# Altium project LM-CT-001.PrjPcb
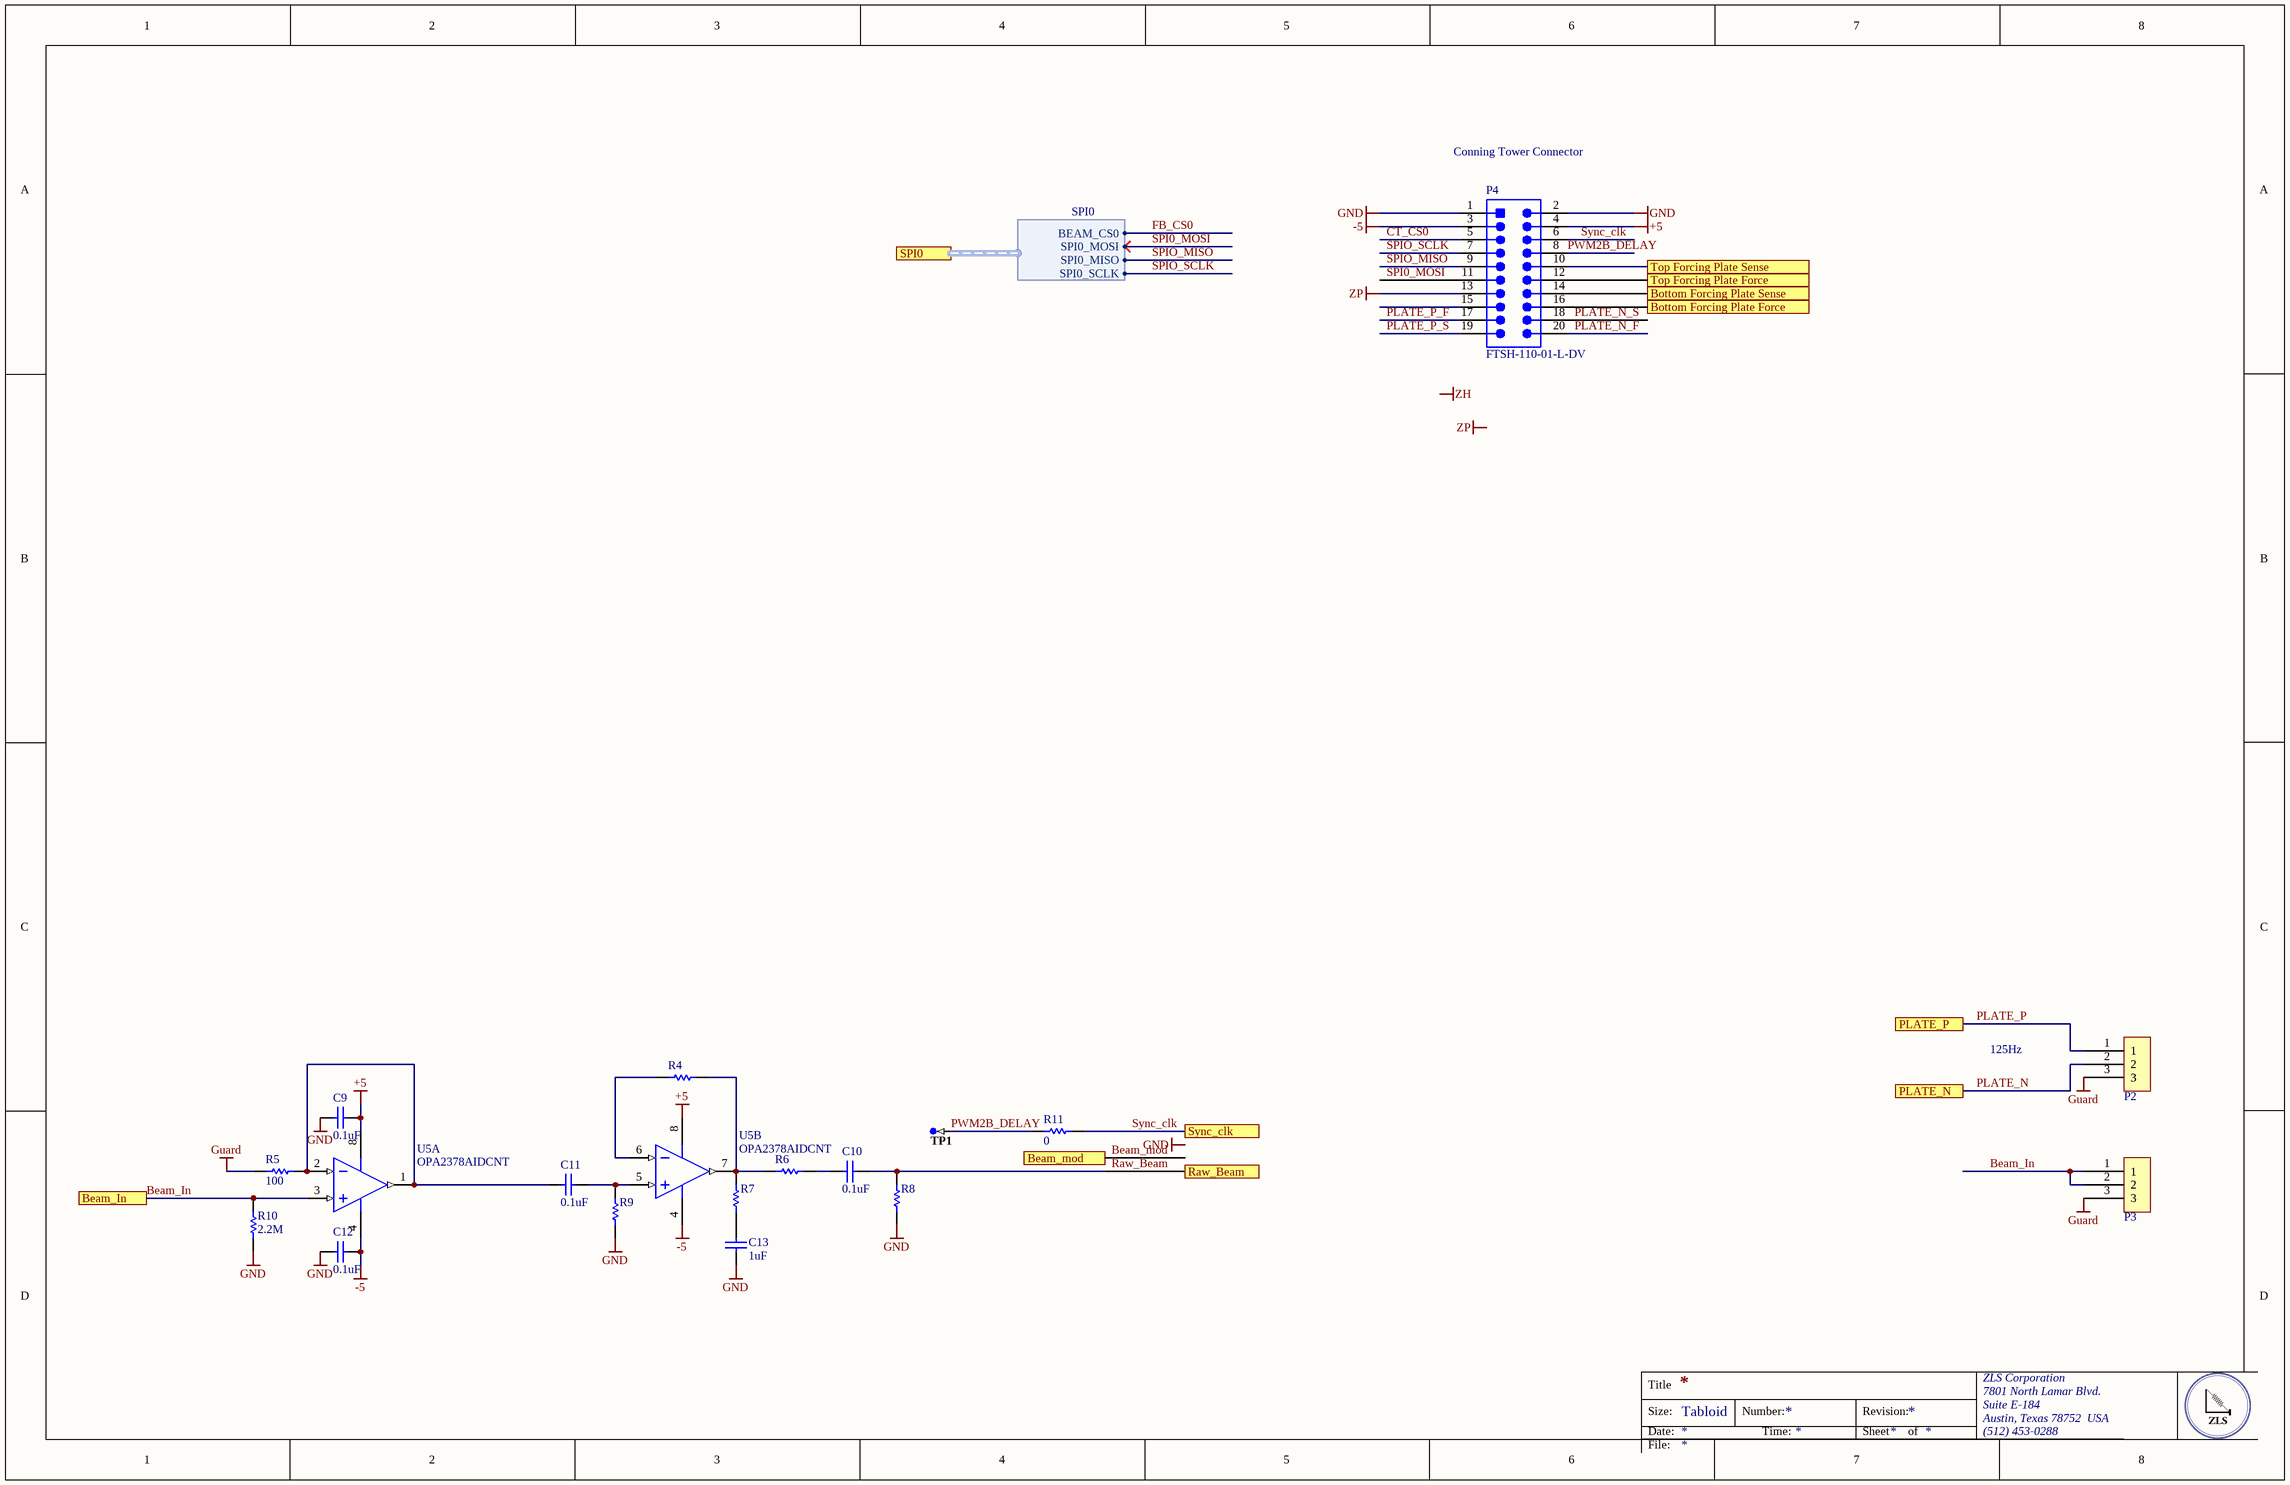
[diagram p0: Beam_Amp.SchDoc]
3 sheets, 57 parts. Net scope: flat (ports and power ports of the same name join across sheets).
Board file: LM-CT-001.PcbDoc
Sheets:
  Beam_Amp.SchDoc
  Synch_Demod.SchDoc
  ADC.SchDoc

## Sheet Beam_Amp.SchDoc
size Tabloid

### Parts
(Parts that share a designator on the sheet are numbered #1, #2 ... from top to bottom, then left to right.)
C9#1  0.1uF  [CAPC0402(1005)60_L]
C10#1  0.1uF  [CAPC0402(1005)60_L]
C11#1  0.1uF  [CAPC0402(1005)60_L]
C12#1  0.1uF  [CAPC0402(1005)60_L]
C13#1  1uF  [CAPC0402(1005)60_L]
P2#1  Triax_Conn  [Triax_Conn]  (value not drawn)
P3  Triax_Conn  [Triax_Conn]  (value not drawn)
P4#1  FTSH-110-01-L-DV  [SMTC-FTSH-110-01-L-DV_V]
R4#1  (no value)  [RESC0402(1005)_M]
R5#1  100  [RESC0402(1005)_M]
R6#1  (no value)  [RESC0402(1005)_M]
R7#1  (no value)  [RESC0402(1005)_M]
R8#1  (no value)  [RESC0402(1005)_M]
R9#1  (no value)  [RESC0402(1005)_M]
R10#1  2.2M  [RESC0402(1005)_M]
R11#1  0  [RESC0805(2012)_L]
TP1#1  TP-SM-C-100  [TP-SM-C-100]  (value not drawn)  (no BOM)
U5#1  OPA2378AIDCNT  [DCN0008A_M]  (parts A,B of 2)

### Ports
Beam_In, Beam_mod, Bottom Forcing Plate Force, Bottom Forcing Plate Sense, PLATE_N, PLATE_P, Raw_Beam, SPI0 (harness SPI0), Sync_clk, Top Forcing Plate Force, Top Forcing Plate Sense

### Harnesses
SPI0: BEAM_CS0, SPI0_MOSI, SPI0_MISO, SPI0_SCLK

### Nets
+5: C9#1.2 P4#1.4 U5#1.8(V+)
-5: C12#1.2 P4#1.3 U5#1.4(V-)
GND: C9#1.1 C12#1.1 C13#1.1 P4#1.1 P4#1.2 R8#1.2 R9#1.2 R10#1.1
Guard: P2#1.3 P3.3 R5#1.2
ZP: P4#1.13
Beam_In: P3.1 P3.2 R10#1.2 U5#1.3(IN_A+) ; port Beam_In
CT_CS0: P4#1.5
PLATE_N: P2#1.2 ; port PLATE_N
PLATE_N_F: P4#1.20
PLATE_N_S: P4#1.18
PLATE_P: P2#1.1 ; port PLATE_P
PLATE_P_F: P4#1.17
PLATE_P_S: P4#1.19
PWM2B_DELAY: P4#1.8 R11#1.1 TP1#1.1
Raw_Beam: C10#1.2 R8#1.1 ; port Raw_Beam
SPI0_MOSI: P4#1.11 ; port SPI0.SPI0_MOSI
SPIO_MISO: P4#1.9 ; port SPI0.SPI0_MISO
SPIO_SCLK: P4#1.7 ; port SPI0.SPI0_SCLK
Sync_clk: P4#1.6 R11#1.2 ; port Sync_clk
NetC10#1_1: C10#1.1 R6#1.1
NetC11#1_1: C11#1.1 R5#1.1 U5#1.1(OUT_A) U5#1.2(IN_A-)
NetC11#1_2: C11#1.2 R9#1.1 U5#1.5(IN_B+)
NetC13#1_2: C13#1.2 R7#1.2
NetP4#1_10: P4#1.10 ; port Top Forcing Plate Sense
NetP4#1_12: P4#1.12 ; port Top Forcing Plate Force
NetP4#1_14: P4#1.14 ; port Bottom Forcing Plate Sense
NetP4#1_16: P4#1.16 ; port Bottom Forcing Plate Force
NetR4#1_1: R4#1.1 R6#1.2 R7#1.1 U5#1.7(OUT_B)
NetR4#1_2: R4#1.2 U5#1.6(IN_B-)

Not connected (* = marked no-connect by the designer): P4#1 15

### Notes on the sheet
- Conning Tower Connector
- 125Hz
- Labels drawn without touching a wire or pin: GND, ZH, ZP
- Title
- Size:
- Date:
- Tabloid
- Number:
- Time:
- Revision:
- Sheet
- of
- ZLS Corporation
- 7801 North Lamar Blvd.
- Suite E-184
- Austin, Texas 78752  USA
- (512) 453-0288
- File:

### Library data of the parts
C9#1 C10#1 C11#1 C12#1 C13#1 = CMP-1034-00252-1: CAP CER 0.1UF 10V X7R 0402; Manufacturer: Murata Electronics North America; Manufacturer Part Number: GRM155R71A104KA01D; Tolerance: ±10%; Supplier 1: Digi-Key; Supplier Part Number 1: 490-6321-1-ND; RoHS: RoHS Compliant; Category: Capacitors; Stock 1: 2920395; Pricing 1: 1=0.1, 10=0.014, 100=0.0063, 500=0.00446, 1000=0.00351, 2500=0.00319, 5000=0.00293 (USD); Packaging: Cut Tape (CT); Part Status: Active; Voltage - Rated: 10V; Temperature Coefficient: X7R; Operating Temperature: -55°C ~ 125°C; Features: -; Ratings: -; Applications: General Purpose; Mounting Type: Surface Mount, MLCC; Package / Case: 0402 (1005 Metric); Size / Dimension: 0.039" L x 0.020" W (1.00mm x 0.50mm); Height - Seated (Max): -; Thickness (Max): 0.022" (0.55mm); Lead Spacing: -; ComponentLink1URL: http://www.murata.com/~/media/webrenewal/support/library/catalog/products/capacitor/mlcc/c02e.ashx?la=en-us; ComponentLink1Description: http://www.murata.com/~/media/webrenewal/support/library/catalog/products/capacitor/mlcc/c02e.ashx?la=en-us
P4#1 = CMP-2000-06294-2: Male Header, Pitch 1.27 mm, 2 x 10 Position, Height 6.1 mm, -55 to 125 degC, RoHS, Tube; Manufacturer: Samtec; Online Catalog: FTSHSeries; Number of Positions Loaded: All; Connector Type: Header,Unshrouded; Product Training Modules: Board-to-BoardConnectors; Featured Product: Board-To-BoardInterconnectSystems; Other Names: SAM1161-10; EDA / CAD Models: DownloadfromAcceleratedDesigns; Number of Positions: 20; Catalog Drawings: FTSHSeriesFTSHSeriesSMTSide; Package Reference: FTSH-110-01-L-DV; Family: RectangularConnectors-Headers,MalePins; Mounting Technology: SurfaceMount; Contact Type: MalePin; Manufacturer URL: http://www.samtec.com/; Package URL: http://suddendocs.samtec.com/prints/ftsh-1xx-xx-xxx-dv-xxx-xxx-mkt.pdf; Package Description: Male Header, Pitch 1.27 mm, 2 x 10 Position, Height 6.1 mm; Packaging: Bulk; Termination: Solder; Category: Connectors,Interconnects; Fastening Type: -; Datasheet Version: F-215 , 02/2016; Contact Finish Thickness: 10µin(0.25µm); Number of Rows: 2; Datasheet URL: http://suddendocs.samtec.com/catalog_english/ftsh_smt.pdf; Mounting Type: SurfaceMount; Series: FTSH; Features: -; Contact Finish: Gold; Standard Package: 1; Color: Black
R4#1 R5#1 R6#1 R7#1 R8#1 R9#1 R10#1 = CMP-1011-00463-1
R11#1 = CMP-1013-00215-1: RES SMD 0 OHM JUMPER 1/8W 0805; Manufacturer: Panasonic Electronic Components; Manufacturer Part Number: ERJ-6GEY0R00V; Power (Watts): 0.125W, 1/8W; Supplier 1: Digi-Key; Supplier Part Number 1: P0.0ACT-ND; RoHS: RoHS Compliant; Category: Resistors; Stock 1: 3414819; Pricing 1: 1=0.1, 10=0.074, 25=0.0532, 50=0.0406, 100=0.03, 250=0.02288, 500=0.0183, 1000=0.01347 (USD); Packaging: Cut Tape (CT); Part Status: Active; Tolerance: Jumper; Composition: Thick Film; Features: Automotive AEC-Q200; Temperature Coefficient: -; Operating Temperature: -55°C ~ 155°C; Package / Case: 0805 (2012 Metric); Supplier Device Package: 0805; Size / Dimension: 0.079" L x 0.049" W (2.00mm x 1.25mm); Height - Seated (Max): 0.028" (0.70mm); Failure Rate: -; ComponentLink1URL: http://industrial.panasonic.com/www-cgi/jvcr13pz.cgi?E+PZ+3+AOA0001+ERJ6GEY0R00V+7+WW; ComponentLink1Description: http://industrial.panasonic.com/www-cgi/jvcr13pz.cgi?E+PZ+3+AOA0001+ERJ6GEY0R00V+7+WW
TP1#1 = CMP-0484-00002-2: Test Point, Surface Mount, Circular, Pad Diameter 1 mm; Manufacturer: No Vendor; PartNumber: TP-SM-C-100
U5#1 = CMP-0272-01124-3: Low-Noise, 900 kHz, RRIO, Precision Operational Amplifier, Zero-Drift Series, 2.2 to 5.5 V, -40 to 125 degC, 8-pin SOP (DCN8), Green (RoHS & no Sb/Br); Manufacturer: Texas Instruments; Number of Channels: 2; Offset Drift(Typ)(uV/C): 0.25; Total Supply Voltage(Min)(+5V is 5, +/-5V is 10): 2.2; Vn at 1kHz(Typ)(nV/rtHz): 20; Iq per channel(Max)(mA): 0.15; Total Supply Voltage(Max)(+5V is 5, +/-5V is 10): 5.5; Sub Family: Low Offset Voltage Amplifier (<=500uV), Low Power Amp (<=500uA), Low Supply Voltage Amplifier (<=2.7V), Precision Amplifier, Zero Drift Precision Amplifier; IIB(Max)(pA): 550; Vio (25C)(Max)(mV): 0.07; CMRR(Min)(dB): 100; Slew Rate(Typ)(V/us): 0.4; PartNumber: OPA2378AIDCNT; DatasheetVersion: SBOS417D; ComponentLink2Description: Datasheet; ComponentLink3URL: http://www.ti.com/lit/ml/mpds099c/mpds099c.pdf; ComponentLink2URL: http://www.ti.com/general/docs/lit/getliterature.tsp?genericPartNumber=OPA2378&fileType=pdf; PackageReference: DCN0008A; PackageDescription: 8-Pin Plastic Small Outline, Body 1.6 x 2.9 mm, Pitch 0.65 mm; Code_JEDEC: MO-178; PackageVersion: 4202106/D, 11/2009; ComponentLink3Description: Package Specification; Eco-Plan: Green (RoHS & no Sb/Br); ComponentLink1Description: Manufacturer URL; Mounting Technology: Surface Mount; ComponentLink1URL: http://www.ti.com/; PartId: 1

## Sheet Synch_Demod.SchDoc
size OrCAD A
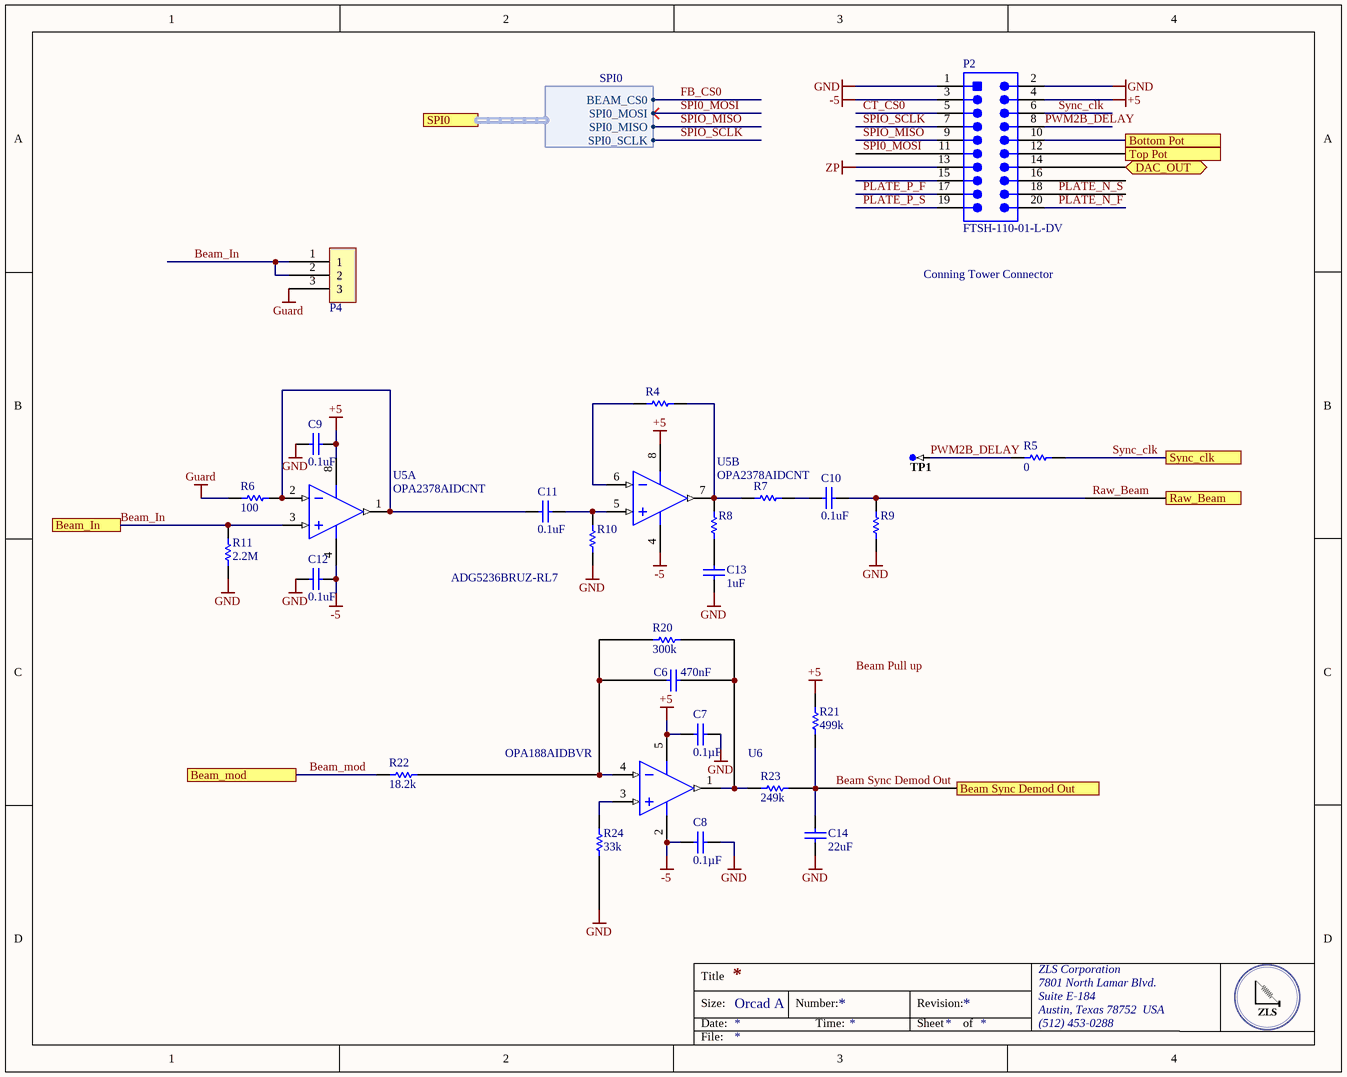
[diagram p1: Synch_Demod.SchDoc]

### Parts
(Parts that share a designator on the sheet are numbered #1, #2 ... from top to bottom, then left to right.)
C6  470nF  [CAPC0805(2012)75_L]
C7  Capacitance: 0.1µF  [CAPC0805(2012)145_N]  (hidden comment: CAP CER 0.1UF 25V X7R 0805)
C8  Capacitance: 0.1µF  [CAPC0805(2012)145_N]  (hidden comment: CAP CER 0.1UF 25V X7R 0805)
C9#2  0.1uF  [CAPC0402(1005)60_L]
C10#2  0.1uF  [CAPC0402(1005)60_L]
C11#2  0.1uF  [CAPC0402(1005)60_L]
C12#2  0.1uF  [CAPC0402(1005)60_L]
C13#2  1uF  [CAPC0402(1005)60_L]
C14  22uF  [CAPC0805(2012)75_L]
P2#2  FTSH-110-01-L-DV  [SMTC-FTSH-110-01-L-DV_V]
P4#2  Triax_Conn  [Triax_Conn]  (value not drawn)
R4#2  (no value)  [RESC0402(1005)_M]
R5#2  0  [RESC0402(1005)_M]
R6#2  100  [RESC0402(1005)_M]
R7#2  (no value)  [RESC0402(1005)_M]
R8#2  (no value)  [RESC0402(1005)_M]
R9#2  (no value)  [RESC0402(1005)_M]
R10#2  (no value)  [RESC0402(1005)_M]
R11#2  2.2M  [RESC0402(1005)_M]
R20  300k  [RESC0402(1005)_M]
R21  499k  [RESC0402(1005)_M]
R22  18.2k  [RESC0402(1005)_M]
R23  249k  [RESC0402(1005)_M]
R24  33k  [RESC0402(1005)_M]
TP1#2  TP-SM-C-100  [TP-SM-C-100]  (value not drawn)  (no BOM)
U5#2  OPA2378AIDCNT  [DCN0008A_M]  (parts A,B of 2)
U6  OPA188AIDBVR  [DBV0005A_M]

### Ports
Beam Sync Demod Out, Beam_In, Beam_mod, Bottom Pot, DAC_OUT, Raw_Beam, SPI0 (harness SPI0), Sync_clk, Top Pot

### Harnesses
SPI0: BEAM_CS0, SPI0_MOSI, SPI0_MISO, SPI0_SCLK

### Nets
+5: C7.1 C9#2.2 P2#2.4 R21.1 U5#2.8(V+) U6.5(V+)
-5: C8.1 C12#2.2 P2#2.3 U5#2.4(V-) U6.2(V-)
GND: C7.2 C8.2 C9#2.1 C12#2.1 C13#2.1 C14.1 P2#2.1 P2#2.2 R9#2.2 R10#2.2 R11#2.1 R24.2
Guard: P4#2.3 R6#2.2
ZP: P2#2.13
Beam Sync Demod Out: C14.2 R21.2 R23.2 ; port Beam Sync Demod Out
Beam_In: P4#2.1 P4#2.2 R11#2.2 U5#2.3(IN_A+) ; port Beam_In
Beam_mod: R22.1 ; port Beam_mod
CT_CS0: P2#2.5
PLATE_N_F: P2#2.20
PLATE_N_S: P2#2.18
PLATE_P_F: P2#2.17
PLATE_P_S: P2#2.19
PWM2B_DELAY: P2#2.8 R5#2.1 TP1#2.1
Raw_Beam: C10#2.2 R9#2.1 ; port Raw_Beam
SPI0_MOSI: P2#2.11 ; port SPI0.SPI0_MOSI
SPIO_MISO: P2#2.9 ; port SPI0.SPI0_MISO
SPIO_SCLK: P2#2.7 ; port SPI0.SPI0_SCLK
Sync_clk: P2#2.6 R5#2.2 ; port Sync_clk
NetC6_1: C6.1 R20.1 R22.2 U6.4(IN-)
NetC6_2: C6.2 R20.2 R23.1 U6.1(OUT)
NetC10#2_1: C10#2.1 R7#2.1
NetC11#2_1: C11#2.1 R6#2.1 U5#2.1(OUT_A) U5#2.2(IN_A-)
NetC11#2_2: C11#2.2 R10#2.1 U5#2.5(IN_B+)
NetC13#2_2: C13#2.2 R8#2.2
NetP2#2_10: P2#2.10 ; port Bottom Pot
NetP2#2_12: P2#2.12 ; port Top Pot
NetP2#2_14: P2#2.14 ; port DAC_OUT
NetR4#2_1: R4#2.1 R7#2.2 R8#2.1 U5#2.7(OUT_B)
NetR4#2_2: R4#2.2 U5#2.6(IN_B-)
NetR24_1: R24.1 U6.3(IN+)

Not connected (* = marked no-connect by the designer): P2#2 15 16

### Notes on the sheet
- Conning Tower Connector
- ADG5236BRUZ-RL7
- Labels drawn without touching a wire or pin: Beam Pull up
- Title
- Size:
- Date:
- Orcad A
- Number:
- Time:
- Revision:
- Sheet
- of
- ZLS Corporation
- 7801 North Lamar Blvd.
- Suite E-184
- Austin, Texas 78752  USA
- (512) 453-0288
- File:

### Library data of the parts
C6 = CMP-1036-02117-1: CAP CER 0.47UF 25V X7R 0805; Manufacturer: Murata Electronics North America; Manufacturer Part Number: GRM219R71E474KA88D; Tolerance: ±10%; Supplier 1: Digi-Key; Supplier Part Number 1: 490-11584-1-ND; RoHS: RoHS Compliant; Category: Capacitors; Stock 1: 410; Pricing 1: 1=0.38, 10=0.262, 100=0.1573, 500=0.118, 1000=0.09964 (USD); Packaging: Cut Tape (CT); Part Status: Active; Voltage - Rated: 25V; Temperature Coefficient: X7R; Operating Temperature: -55°C ~ 125°C; Features: -; Ratings: -; Applications: General Purpose; Mounting Type: Surface Mount, MLCC; Package / Case: 0805 (2012 Metric); Size / Dimension: 0.079" L x 0.049" W (2.00mm x 1.25mm); Height - Seated (Max): -; Thickness (Max): 0.037" (0.95mm); Lead Spacing: -; Lead Style: -; ComponentLink1URL: https://www.murata.com/~/media/webrenewal/support/library/catalog/products/capacitor/mlcc/c02e.ashx?la=en-us; ComponentLink1Description: https://www.murata.com/~/media/webrenewal/support/library/catalog/products/capacitor/mlcc/c02e.ashx?la=en-us
C7 C8 = CMP-1036-04795-1: Manufacturer: Murata Electronics North America; Manufacturer Part Number: GRM21BR71E104KA01L; Tolerance: ±10%; Supplier 1: Digi-Key; Supplier Part Number 1: 490-1673-6-ND; RoHS: RoHS Compliant; Category: Capacitors; Stock 1: 891652; Pricing 1: 1=0.2, 10=0.145, 100=0.0683, 500=0.04788, 1000=0.03964 (USD); Packaging: Digi-Reel®; Part Status: Active; Voltage - Rated: 25V; Temperature Coefficient: X7R; Operating Temperature: -55°C ~ 125°C; Features: -; Ratings: -; Applications: General Purpose; Mounting Type: Surface Mount, MLCC; Package / Case: 0805 (2012 Metric); Size / Dimension: 0.079" L x 0.049" W (2.00mm x 1.25mm); Height - Seated (Max): -; Thickness (Max): 0.053" (1.35mm); Lead Spacing: -; Lead Style: -; ComponentLink1URL: http://www.murata.com/~/media/webrenewal/support/library/catalog/products/capacitor/mlcc/c02e.ashx; ComponentLink1Description: http://www.murata.com/~/media/webrenewal/support/library/catalog/products/capacitor/mlcc/c02e.ashx
C9#2 C10#2 C11#2 C12#2 C13#2 = CMP-1034-00252-1: as C9#1 on sheet Beam_Amp; Supplier 1: Digi-Key; Supplier Part Number 1: 490-6321-1-ND; RoHS: RoHS Compliant; Category: Capacitors; Stock 1: 2920395; Pricing 1: 1=0.1, 10=0.014, 100=0.0063, 500=0.00446, 1000=0.00351, 2500=0.00319, 5000=0.00293 (USD); Packaging: Cut Tape (CT); Part Status: Active; Voltage - Rated: 10V; Temperature Coefficient: X7R; Operating Temperature: -55°C ~ 125°C; Features: -; Ratings: -; Applications: General Purpose; Mounting Type: Surface Mount, MLCC; Package / Case: 0402 (1005 Metric); Size / Dimension: 0.039" L x 0.020" W (1.00mm x 0.50mm); Height - Seated (Max): -; Thickness (Max): 0.022" (0.55mm); Lead Spacing: -; ComponentLink1URL: http://www.murata.com/~/media/webrenewal/support/library/catalog/products/capacitor/mlcc/c02e.ashx?la=en-us; ComponentLink1Description: http://www.murata.com/~/media/webrenewal/support/library/catalog/products/capacitor/mlcc/c02e.ashx?la=en-us
C14 = CMP-1036-02117-1: CAP CER 22UF 25V X5R 0805; Manufacturer: Murata Electronics North America; Manufacturer Part Number: GRM21BR61E226ME44L; Tolerance: ±20%; Notification: Current market demand for these product types have resulted in fluctuating and extending lead times. Lead times may differ.; Supplier 1: Digi-Key; Supplier Part Number 1: 490-10749-1-ND; RoHS: RoHS Compliant; Category: Capacitors; Stock 1: 2004; Pricing 1: 1=0.57, 10=0.404, 100=0.2663, 500=0.19722, 1000=0.16764 (USD); Packaging: Cut Tape (CT); Part Status: Active; Voltage - Rated: 25V; Temperature Coefficient: X5R; Operating Temperature: -55°C ~ 85°C; Features: -; Ratings: -; Applications: General Purpose; Mounting Type: Surface Mount, MLCC; Package / Case: 0805 (2012 Metric); Size / Dimension: 0.079" L x 0.049" W (2.00mm x 1.25mm); Height - Seated (Max): -; Thickness (Max): 0.057" (1.45mm); Lead Spacing: -; Lead Style: -; ComponentLink1URL: http://search.murata.co.jp/Ceramy/image/img/A01X/G101/ENG/GRM21BR61E226ME44-01.pdf; ComponentLink1Description: http://search.murata.co.jp/Ceramy/image/img/A01X/G101/ENG/GRM21BR61E226ME44-01.pdf
P2#2 = CMP-2000-06294-2: as P4#1 on sheet Beam_Amp; Package Reference: FTSH-110-01-L-DV; Family: RectangularConnectors-Headers,MalePins; Mounting Technology: SurfaceMount; Contact Type: MalePin; Manufacturer URL: http://www.samtec.com/; Package URL: http://suddendocs.samtec.com/prints/ftsh-1xx-xx-xxx-dv-xxx-xxx-mkt.pdf; Package Description: Male Header, Pitch 1.27 mm, 2 x 10 Position, Height 6.1 mm; Packaging: Bulk; Termination: Solder; Category: Connectors,Interconnects; Fastening Type: -; Datasheet Version: F-215 , 02/2016; Contact Finish Thickness: 10µin(0.25µm); Number of Rows: 2; Datasheet URL: http://suddendocs.samtec.com/catalog_english/ftsh_smt.pdf; Mounting Type: SurfaceMount; Series: FTSH; Features: -; Contact Finish: Gold; Standard Package: 1; Color: Black
R4#2 R5#2 R6#2 R7#2 R8#2 R9#2 R10#2 R11#2 R20-R24 = CMP-1011-00463-1
TP1#2 = CMP-0484-00002-2: as TP1#1 on sheet Beam_Amp; PartNumber: TP-SM-C-100
U5#2 = CMP-0272-01124-3: as U5#1 on sheet Beam_Amp; PartNumber: OPA2378AIDCNT; DatasheetVersion: SBOS417D; ComponentLink2Description: Datasheet; ComponentLink3URL: http://www.ti.com/lit/ml/mpds099c/mpds099c.pdf; ComponentLink2URL: http://www.ti.com/general/docs/lit/getliterature.tsp?genericPartNumber=OPA2378&fileType=pdf; PackageReference: DCN0008A; PackageDescription: 8-Pin Plastic Small Outline, Body 1.6 x 2.9 mm, Pitch 0.65 mm; Code_JEDEC: MO-178; PackageVersion: 4202106/D, 11/2009; ComponentLink3Description: Package Specification; Eco-Plan: Green (RoHS & no Sb/Br); ComponentLink1Description: Manufacturer URL; Mounting Technology: Surface Mount; ComponentLink1URL: http://www.ti.com/; PartId: 1
U6 = CMP-0809-00005-2: Precision, Low Noise, Rail-to-Rail Output, Zero-Drift Operational Amplifier, 4 to 36 V, -40 to 125 degC, 5-pin SOT23 (DBV5), Green (RoHS & no Sb/Br); Manufacturer: Texas Instruments; Total Supply Voltage(Min)(+5V is 5, +/-5V is 10): 4; Offset Drift(Typ)(uV/C): 0.03; Rating: Catalog; SubFamily: Zero Drift Precision Amplifier; GBW(Typ)(MHz): 2; Slew Rate(Typ)(V/us): 0.8; Number of Channels: 1; CMRR(Min)(dB): 120; Iq per channel(Max)(mA): 0.51; Total Supply Voltage(Max)(+5V is 5, +/-5V is 10): 36; PartNumber: OPA188AIDBVR; ComponentLink2Description: Datasheet; ComponentLink2URL: http://www.ti.com/lit/ds/symlink/opa188.pdf; ComponentLink1Description: Manufacturer URL; Mounting Technology: Surface Mount; Eco-Plan: Green (RoHS & no Sb/Br); ComponentLink1URL: http://www.ti.com/; PackageVersion: 4073253-4/K, 03/2006; DatasheetVersion: SBOS642A; ComponentLink3Description: Package Specification; PackageReference: DBV0005A; ComponentLink3URL: http://www.ti.com/litv/pdf/mpds018i; PackageDescription: 5-Pin Plastic Small Outline, Body 1.6 x 2.9 mm, Pitch 0.95 mm; Code_JEDEC: MO-178

## Sheet ADC.SchDoc
size OrCAD A
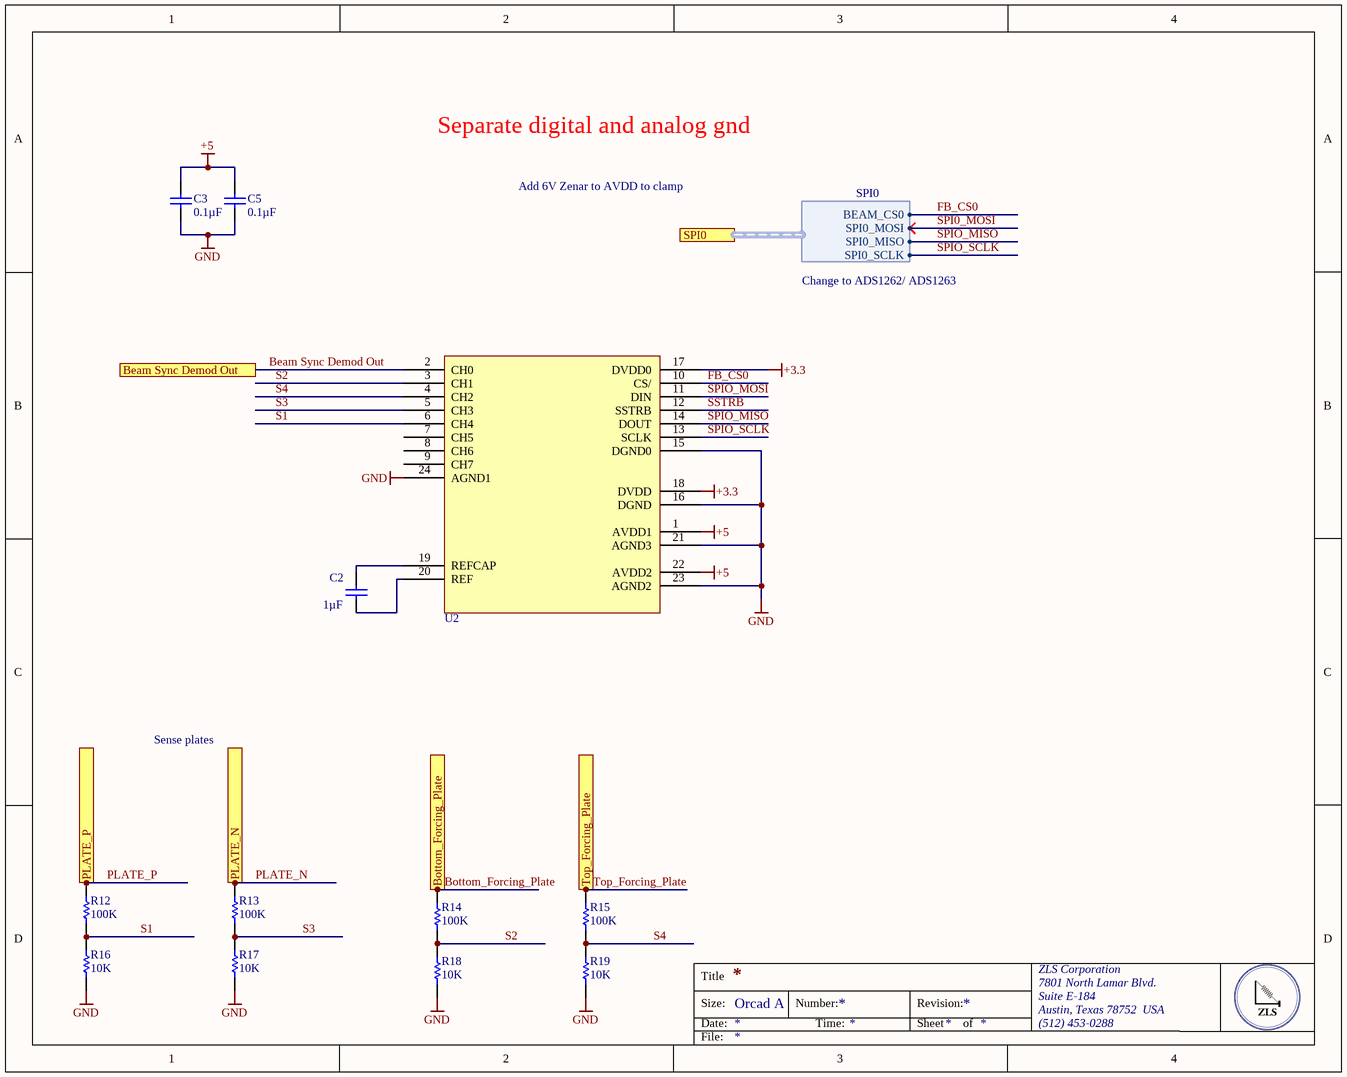
[diagram p2: ADC.SchDoc]

### Parts
C2  Capacitance: 1µF  [CAPC0805(2012)145_N]  (hidden comment: CAP CER 0.1UF 25V X7R 0805)
C3  Capacitance: 0.1µF  [CAPC0805(2012)145_N]  (hidden comment: CAP CER 0.1UF 25V X7R 0805)
C5  Capacitance: 0.1µF  [CAPC0805(2012)145_N]  (hidden comment: CAP CER 0.1UF 25V X7R 0805)
R12  100K  [RESC0402(1005)_M]
R13  100K  [RESC0402(1005)_M]
R14  100K  [RESC0402(1005)_M]
R15  100K  [RESC0402(1005)_M]
R16  10K  [RESC0402(1005)_M]
R17  10K  [RESC0402(1005)_M]
R18  10K  [RESC0402(1005)_M]
R19  10K  [RESC0402(1005)_M]
U2  MAX1300  [MAX1300]  (value not drawn)

### Ports
Beam Sync Demod Out, Bottom_Forcing_Plate, PLATE_N, PLATE_P, SPI0 (harness SPI0), Top_Forcing_Plate

### Harnesses
SPI0: BEAM_CS0, SPI0_MOSI, SPI0_MISO, SPI0_SCLK

### Nets
+3.3: U2.17(DVDD0) U2.18(DVDD)
+5: C3.2 C5.2 U2.1(AVDD1) U2.22(AVDD2)
GND: C3.1 C5.1 R16.1 R17.1 R18.1 R19.1 U2.15(DGND0) U2.16(DGND) U2.21(AGND3) U2.23(AGND2) U2.24(AGND1)
Beam Sync Demod Out: U2.2(CH0) ; port Beam Sync Demod Out
Bottom_Forcing_Plate: R14.2 ; port Bottom_Forcing_Plate
FB_CS0: U2.10(CS/) ; port SPI0.BEAM_CS0
PLATE_N: R13.2 ; port PLATE_N
PLATE_P: R12.2 ; port PLATE_P
S1: R12.1 R16.2 U2.6(CH4)
S2: R14.1 R18.2 U2.3(CH1)
S3: R13.1 R17.2 U2.5(CH3)
S4: R15.1 R19.2 U2.4(CH2)
SPIO_MISO: U2.14(DOUT) ; port SPI0.SPI0_MISO
SPIO_MOSI: U2.11(DIN)
SPIO_SCLK: U2.13(SCLK) ; port SPI0.SPI0_SCLK
SSTRB: U2.12(SSTRB)
Top_Forcing_Plate: R15.2 ; port Top_Forcing_Plate
NetC2_1: C2.1 U2.19(REFCAP)
NetC2_2: C2.2 U2.20(REF)

Not connected (* = marked no-connect by the designer): U2 7(CH5) 8(CH6) 9(CH7)

### Notes on the sheet
- Separate digital and analog gnd
- Add 6V Zenar to AVDD to clamp
- Change to ADS1262/ ADS1263
- Sense plates
- Title
- Size:
- Date:
- Orcad A
- Number:
- Time:
- Revision:
- Sheet
- of
- ZLS Corporation
- 7801 North Lamar Blvd.
- Suite E-184
- Austin, Texas 78752  USA
- (512) 453-0288
- File:

### Library data of the parts
C2 C3 C5 = CMP-1036-04795-1: as C7 on sheet Synch_Demod; Supplier 1: Digi-Key; Supplier Part Number 1: 490-1673-6-ND; RoHS: RoHS Compliant; Category: Capacitors; Stock 1: 891652; Pricing 1: 1=0.2, 10=0.145, 100=0.0683, 500=0.04788, 1000=0.03964 (USD); Packaging: Digi-Reel®; Part Status: Active; Voltage - Rated: 25V; Temperature Coefficient: X7R; Operating Temperature: -55°C ~ 125°C; Features: -; Ratings: -; Applications: General Purpose; Mounting Type: Surface Mount, MLCC; Package / Case: 0805 (2012 Metric); Size / Dimension: 0.079" L x 0.049" W (2.00mm x 1.25mm); Height - Seated (Max): -; Thickness (Max): 0.053" (1.35mm); Lead Spacing: -; Lead Style: -; ComponentLink1URL: http://www.murata.com/~/media/webrenewal/support/library/catalog/products/capacitor/mlcc/c02e.ashx; ComponentLink1Description: http://www.murata.com/~/media/webrenewal/support/library/catalog/products/capacitor/mlcc/c02e.ashx
R12-R19 = CMP-1011-00463-1

## Nets that join several sheets
+5: Beam_Amp (C9#1.2 P4#1.4 U5#1.8), Synch_Demod (6 pins), ADC (C3.2 C5.2 U2.1 U2.22)
-5: Beam_Amp (C12#1.2 P4#1.3 U5#1.4), Synch_Demod (5 pins)
GND: Beam_Amp (8 pins), Synch_Demod (12 pins), ADC (11 pins)
Guard: Beam_Amp (P2#1.3 P3.3 R5#1.2), Synch_Demod (P4#2.3 R6#2.2)
ZP: Beam_Amp (P4#1.13), Synch_Demod (P2#2.13)
Beam Sync Demod Out: Synch_Demod (C14.2 R21.2 R23.2), ADC (U2.2)
Beam_In: Beam_Amp (P3.1 P3.2 R10#1.2 U5#1.3), Synch_Demod (P4#2.1 P4#2.2 R11#2.2 U5#2.3)
PLATE_N: Beam_Amp (P2#1.2), ADC (R13.2)
PLATE_P: Beam_Amp (P2#1.1), ADC (R12.2)
Raw_Beam: Beam_Amp (C10#1.2 R8#1.1), Synch_Demod (C10#2.2 R9#2.1)
SPI0_MOSI: Beam_Amp (P4#1.11), Synch_Demod (P2#2.11)
SPIO_MISO: Beam_Amp (P4#1.9), Synch_Demod (P2#2.9), ADC (U2.14)
SPIO_SCLK: Beam_Amp (P4#1.7), Synch_Demod (P2#2.7), ADC (U2.13)
Sync_clk: Beam_Amp (P4#1.6 R11#1.2), Synch_Demod (P2#2.6 R5#2.2)